# Altium schematic sheet LCD-Battery.SchDoc: Audio_Moduloop - LCD/Battery
size A; Date: 2/27/2024; DrawnBy: Team 28: Ryan Gordon, Conor Curtin, Evan Roveili, Shawn Colby; DocumentNumber: 9; Revision: V1; SheetNumber: 9; SheetTotal: 9
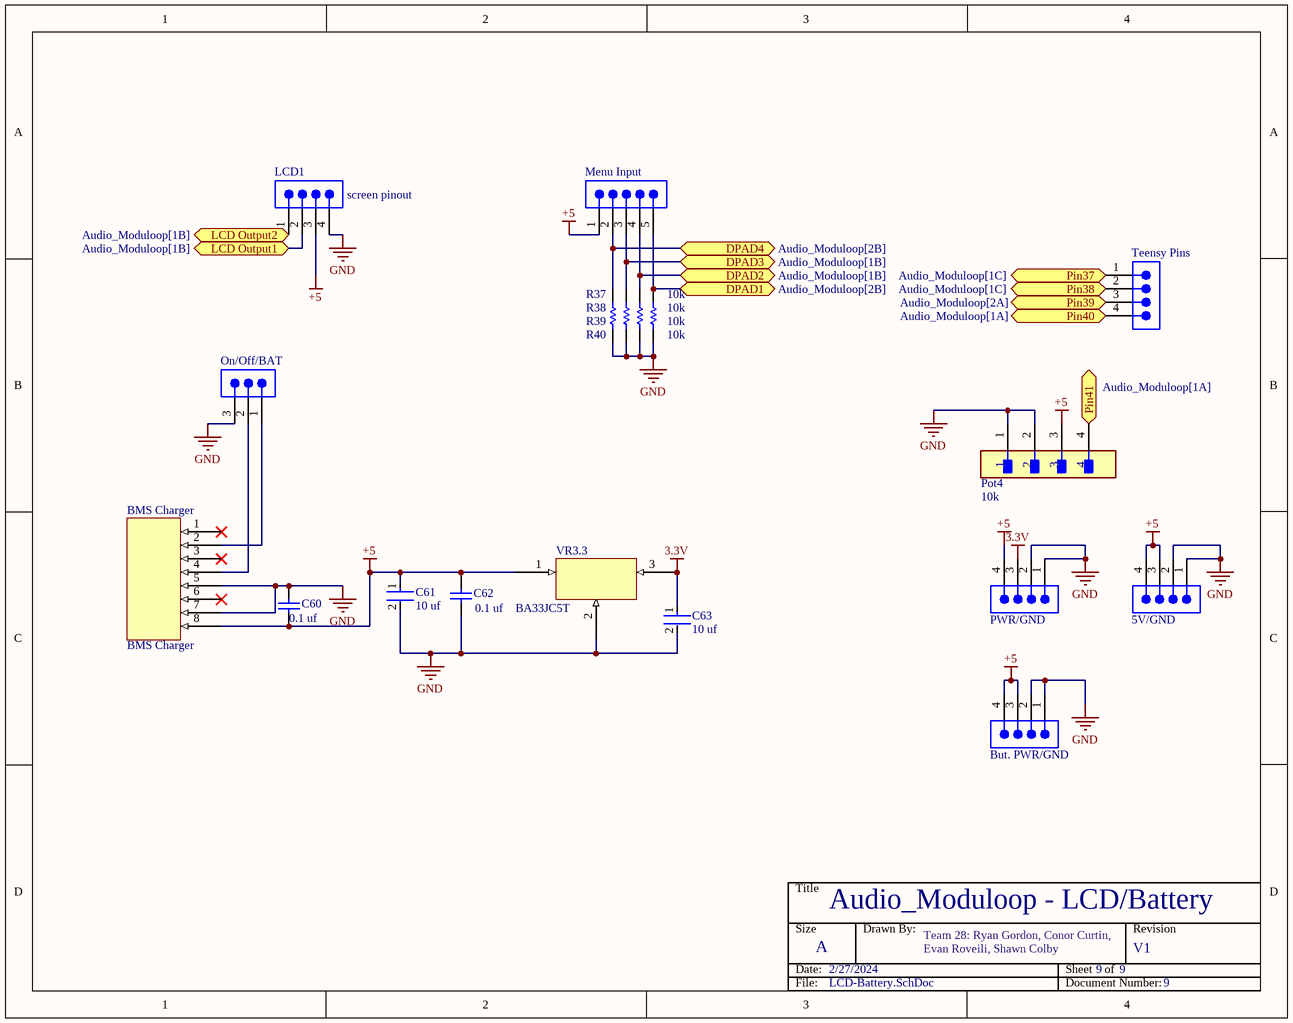
[diagram p0: LCD-Battery.SchDoc]

## Parts
5V/GND  61300411121  [61300411121]  (value not drawn)
BMS_Charger  BMS Charger  [MODULE_2465]
But._PWR/GND  61300411121  [61300411121]  (value not drawn)
C60  0.1 uf  [AVX-SA115C104KAR]
C61  10 uf  [FP-RCE3DB-MFG]
C62  0.1 uf  [AVX-SA115C104KAR]
C63  10 uf  [FP-RCE3DB-MFG]
LCD1  screen pinout  [61900411121]
Menu_Input  61300511121  [61300511121]  (value not drawn)
On/Off/BAT  TSW-103-07-F-S  [SMTC-TSW-103-07-X-S]  (value not drawn)
Pot4  10k  [FP-B4B-XH-A_LF_SN-MFG]
PWR/GND  61300411121  [61300411121]  (value not drawn)
R37  10k  [RESC2013X60X35NL10T20]
R38  10k  [RESC2013X60X35NL10T20]
R39  10k  [RESC2013X60X35NL10T20]
R40  10k  [RESC2013X60X35NL10T20]
Teensy_Pins  61300411121  [61300411121]  (value not drawn)
VR3.3  BA33JC5T  [TO254P1030X480X2260-3]

## Ports
DPAD1 (bidir, see Audio_Moduloop[2B]), DPAD2 (bidir, see Audio_Moduloop[1B]), DPAD3 (bidir, see Audio_Moduloop[1B]), DPAD4 (bidir, see Audio_Moduloop[2B]), LCD Output1 (bidir, see Audio_Moduloop[1B]), LCD Output2 (bidir, see Audio_Moduloop[1B]), Pin37 (bidir, see Audio_Moduloop[1C]), Pin38 (bidir, see Audio_Moduloop[1C]), Pin39 (bidir, see Audio_Moduloop[2A]), Pin40 (bidir, see Audio_Moduloop[1A]), Pin41 (bidir, see Audio_Moduloop[1A])

## Nets
3.3V: C63.1 PWR/GND.3 VR3.3.3
+5: 5V/GND.3 5V/GND.4 BMS_Charger.8 But._PWR/GND.3 But._PWR/GND.4 C60.1 C61.1 C62.2 LCD1.3 Menu_Input.1 Pot4.3 PWR/GND.4 VR3.3.1
GND: 5V/GND.1 5V/GND.2 BMS_Charger.5 BMS_Charger.7 But._PWR/GND.1 But._PWR/GND.2 C60.2 C61.2 C62.1 C63.2 LCD1.4 On/Off/BAT.3 Pot4.1 Pot4.2 PWR/GND.1 PWR/GND.2 R37.2 R38.2 R39.2 R40.2 VR3.3.2
DPAD1: Menu_Input.5 R40.1 ; port DPAD1
DPAD2: Menu_Input.4 R39.1 ; port DPAD2
DPAD3: Menu_Input.3 R38.1 ; port DPAD3
DPAD4: Menu_Input.2 R37.1 ; port DPAD4
LCD Output1: LCD1.2 ; port LCD Output1
LCD Output2: LCD1.1 ; port LCD Output2
Pin37: Teensy_Pins.1 ; port Pin37
Pin38: Teensy_Pins.2 ; port Pin38
Pin39: Teensy_Pins.3 ; port Pin39
Pin40: Teensy_Pins.4 ; port Pin40
Pin41: Pot4.4 ; port Pin41
NetBMS_Charger_2: BMS_Charger.2 On/Off/BAT.1
NetBMS_Charger_4: BMS_Charger.4 On/Off/BAT.2

Not connected (* = marked no-connect by the designer): BMS_Charger 1* 3* 6*

## Notes on the sheet
- Title
- Size
- Date:
- A
- Drawn By:
- Sheet    of
- Revision
- File:
- Document Number:

## Library data of the parts
5V/GND But._PWR/GND PWR/GND Teensy_Pins = CMP-1502-01064-2: NexarPartId: 32855522; Pitch: 2.54mm; Number of Contacts: 4; Contact Resistance: 20mΩ; Gender: Male; Current Rating: 3A; Connector Type: Male Pin; Voltage Rating: 250V; Lead Free: Lead Free; Contact Plating: Gold; Max Operating Temperature: 105°C; Packaging: Bulk; Height: 8.89mm; Orientation: Vertical; Contact Mating Length: 5.9944mm; Contact Material: Copper; Lead Pitch: 2.54mm; Min Operating Temperature: -40°C; Termination: Solder; Color: Black; Number of Rows: 1; REACH SVHC: Unknown; RoHS: Compliant; Mount: Through Hole; Number of Positions: 4; Number of Pins: 4; Operating Supply Voltage: 250V
BMS_Charger = CMP-00029-00001-2: Holder Battery; AA Battery; 3 Cells; 6 in. Wire Lead; Chassis Mount; Polypropylene
C60 C62 = CMP-2000-07029-1: Axial Leads / SpinGuard(R), Ceramic Capacitor, 0.10 uF +/- 10%, 50V, -55 to 125 degC, 2-Pin THD, RoHS, Tape and Reel; Manufacturer: AVX; Other Names: 478-3151-1; Catalog Drawings: SASeries_4.32x3.05; Capacitance: 0.1µF; Temperature Coefficient: X7R; Online Catalog: SpinGuard®SASeries; Product Training Modules: ComponentSolutionsforSmartMeterApplications; Category: Capacitors; Package Description: 2-Pin Axial Lead, Dia 3.05 mm, Body Length 4.32 mm; Standard Package: 1; Mounting Technology: ThroughHole; Ratings: -; Datasheet Version: 06/2007; Voltage - Rated: 50V; Tolerance: ±10%; Package Reference: SA115C104KAR; Packaging: -; Lead Style: -; Size / Dimension: 0.120"Diax0.170"L(3.05mmx4.32mm); Mounting Type: ThroughHole; Operating Temperature: -55°C~125°C; Datasheet URL: https://datasheet.ciiva.com/27051/1074183-27051369.pdf; Applications: GeneralPurpose; Thickness (Max): -; Lead Spacing: -; Height - Seated (Max): -; Family: CeramicCapacitors; Package / Case: Axial; Features: -; Series: SpinGuard®SA; Manufacturer URL: http://www.avx.com/
C61 C63 = CMP-06035-005830-1: Cap Ceramic 10uF 25V X7R ±10% Radial 2.5mm +125°C Automotive Ammo Pack; Lead/Base Style: Straight; Lead Diameter: 0.5mm; Case/Package: Radial; Voltage Rating (DC): 25V; Tolerance: 10%; Lead Pitch: 0.098inch; Termination: Radial; Height - Seated (Max): 0.197inch; Resistor Type: Ceramic; Min Operating Temperature: -55°C; Dielectric: X7R; Length: 0.217inch; Voltage Rating: 25V; Width: 0.157inch; Height: 5mm; Packaging: Tape and Reel; Ratings: AEC-Q200; Max Operating Temperature: 125°C; Package Quantity: 1500; Mount: Through Hole; Capacitance: 10uF
LCD1 = CMP-1502-00586-2: NexarPartId: 18818226; Connector Type: Male Pin; Insulation: Insulated; Number of Positions: 4; Gender: Male; Operating Supply Voltage: 250V; Pitch: 2.54mm; Current Rating: 3A; Insulation Resistance: 1GΩ; Contact Resistance: 20mΩ; Termination: Through Hole; Contact Material: Copper; Height: 3.3mm; Width: 10.2mm; RoHS: Compliant; REACH SVHC: Unknown; Max Operating Temperature: 105°C; Contact Plating: Tin; Lead Free: Lead Free; Contact Gender: Male; Lead Pitch: 2.54mm; Flammability Rating: UL94 V-0; Packaging: Bulk; Housing Material: Nylon; Number of Pins: 4; Number of Contacts: 4; Color: Beige; Number of Rows: 1; Orientation: Vertical; Contact Mating Length: 7.493mm; Mount: Through Hole; Min Operating Temperature: -40°C; Voltage Rating: 250V; Fastening Type: Friction; Length: 10.16mm
Menu_Input = CMP-1502-01068-2: NexarPartId: 32855526; Operating Supply Voltage: 250V; Number of Contacts: 5; Connector Type: Male Pin; Current Rating: 3A; Contact Resistance: 20mΩ; Pitch: 2.54mm; Gender: Male; Termination: Solder; RoHS: Compliant; Lead Pitch: 2.54mm; Contact Mating Length: 5.9944mm; Number of Positions: 5; Lead Free: Lead Free; Contact Plating: Gold; Number of Pins: 5; Min Operating Temperature: -40°C; Voltage Rating: 250V; Color: Black; Mount: Through Hole; REACH SVHC: Unknown; Packaging: Bulk; Height: 8.89mm; Number of Rows: 1; Orientation: Vertical; Contact Material: Copper; Max Operating Temperature: 105°C
On/Off/BAT = CMP-1024-00331-1: 0.025" SQ Post Header, Through-hole, Vertical, -55 to 125 degC, 2.54 mm Pitch, 3-Pin, Male, RoHS; Manufacturer: Samtec; Pitch: 2.54 mm; DatasheetVersion: F-214; ComponentLink1Description: Manufacturer URL; ComponentLink3URL: http://www.samtec.com/documents/webfiles/cpdf/TSW-XXX-XX-XXX-X-XX-XXX-MKT.pdf; Mounting Technology: Through-hole; PackageDescription: .025[0.64] SQ. Post Terminal Strip Assembly; Temperature Range: -55 to 125 degC; ComponentLink3Description: Package Specification; Orientation: Vertical; PartNumber: TSW-103-07-F-S; RoHS: True; PackageVersion: DM, 8/1988; ComponentLink2Description: Datasheet; ComponentLink1URL: http://www.samtec.com; ComponentLink2URL: http://www.samtec.com/documents/webfiles/pdf/TSW_TH.PDF; PackageReference: TSW-103-07-X-S
Pot4 = CMP-17439-000250-1: CONN HEADER VERT 4POS 2.5MM; Number of Contacts: 4; Contact Resistance: 20mR; Voltage Rating: 250V; Max Current Rating: 3A; Gender: Male; Wire/Cable Gauge: 22AWG; Mated Stacking Heights: 9.8mm; Insulation Resistance: 1GR; Orientation: Straight; Contact Type: Male Pin; Contact Finish - Mating: TIN; Series: XH; Max Voltage Rating (AC): 250V; Lead Pitch: 2.5mm; Contact Shape: Square; Insulation Color: Natural; Termination: Solder; Lead Free: Lead Free; Voltage Rating (AC): 250V; Number of Rows: 1; Flammability Rating: UL94 V-0; Number of Positions: 4; Max Operating Temperature: 85°C; Package Quantity: 500; Mount: Through Hole; REACH SVHC: No SVHC; Connector Type: Header; Insulation Material: Nylon; Fastening Type: Detent; Min Operating Temperature: -25°C; Housing Color: White; Packaging: Bulk; Contact Plating: Tin; Contact Material: Brass; Max Voltage Rating (DC): 250V; Housing Material: Polyamide; Color: Natural; Material: Polyamide; Pitch: 2.5mm; Depth: 5.75mm; Current Rating: 3A; Length: 12.4mm
R37-R40 = CMP-1659-00013-4: Chip Resistor, 10 KOhm, +/- 1%, 0.125 W, -55 to 155 degC, 0805 (2012 Metric), RoHS, Tape and Reel; Manufacturer: Yageo; Voltage Rating: 150 V; Mount: Surface Mount; ComponentLink1Description: Manufacturer URL; ComponentLink2URL: http://www.yageo.com/documents/recent/PYu-RC_Group_51_RoHS_L_04.pdf; Pins: 2; Length: 2 mm; Min Operating Temperature: -55 degC; Height: 0.5 mm; Mounting Technology: Surface Mount; RoHSCompliant: true; REACH SVHC: No SVHC; ComponentLink1URL: http://www.yageo.com/; Max Operating Temperature: 155 degC; PackageReference: 0805; DatasheetVersion: Rev. 4, 02/2016; Package Quantity: 5000; Packaging: Tape and Reel; ComponentLink2Description: Datasheet; PackageDescription: 2-Pin Surface Mounted Device, Body 2 x 1.25 mm
VR3.3 = CMP-00030-00004-2: Fixed Positive LDO Regulator, 3.3V, 0.5V Dropout, BIPolar; Pins: 3; RoHS Compliant: Yes; Max Operating Temperature: 105°C; Min Operating Temperature: -40°C